# EAGLE design 1602_arduino_ble (EAGLE 8.5.1)

## Sheet 1 of 2
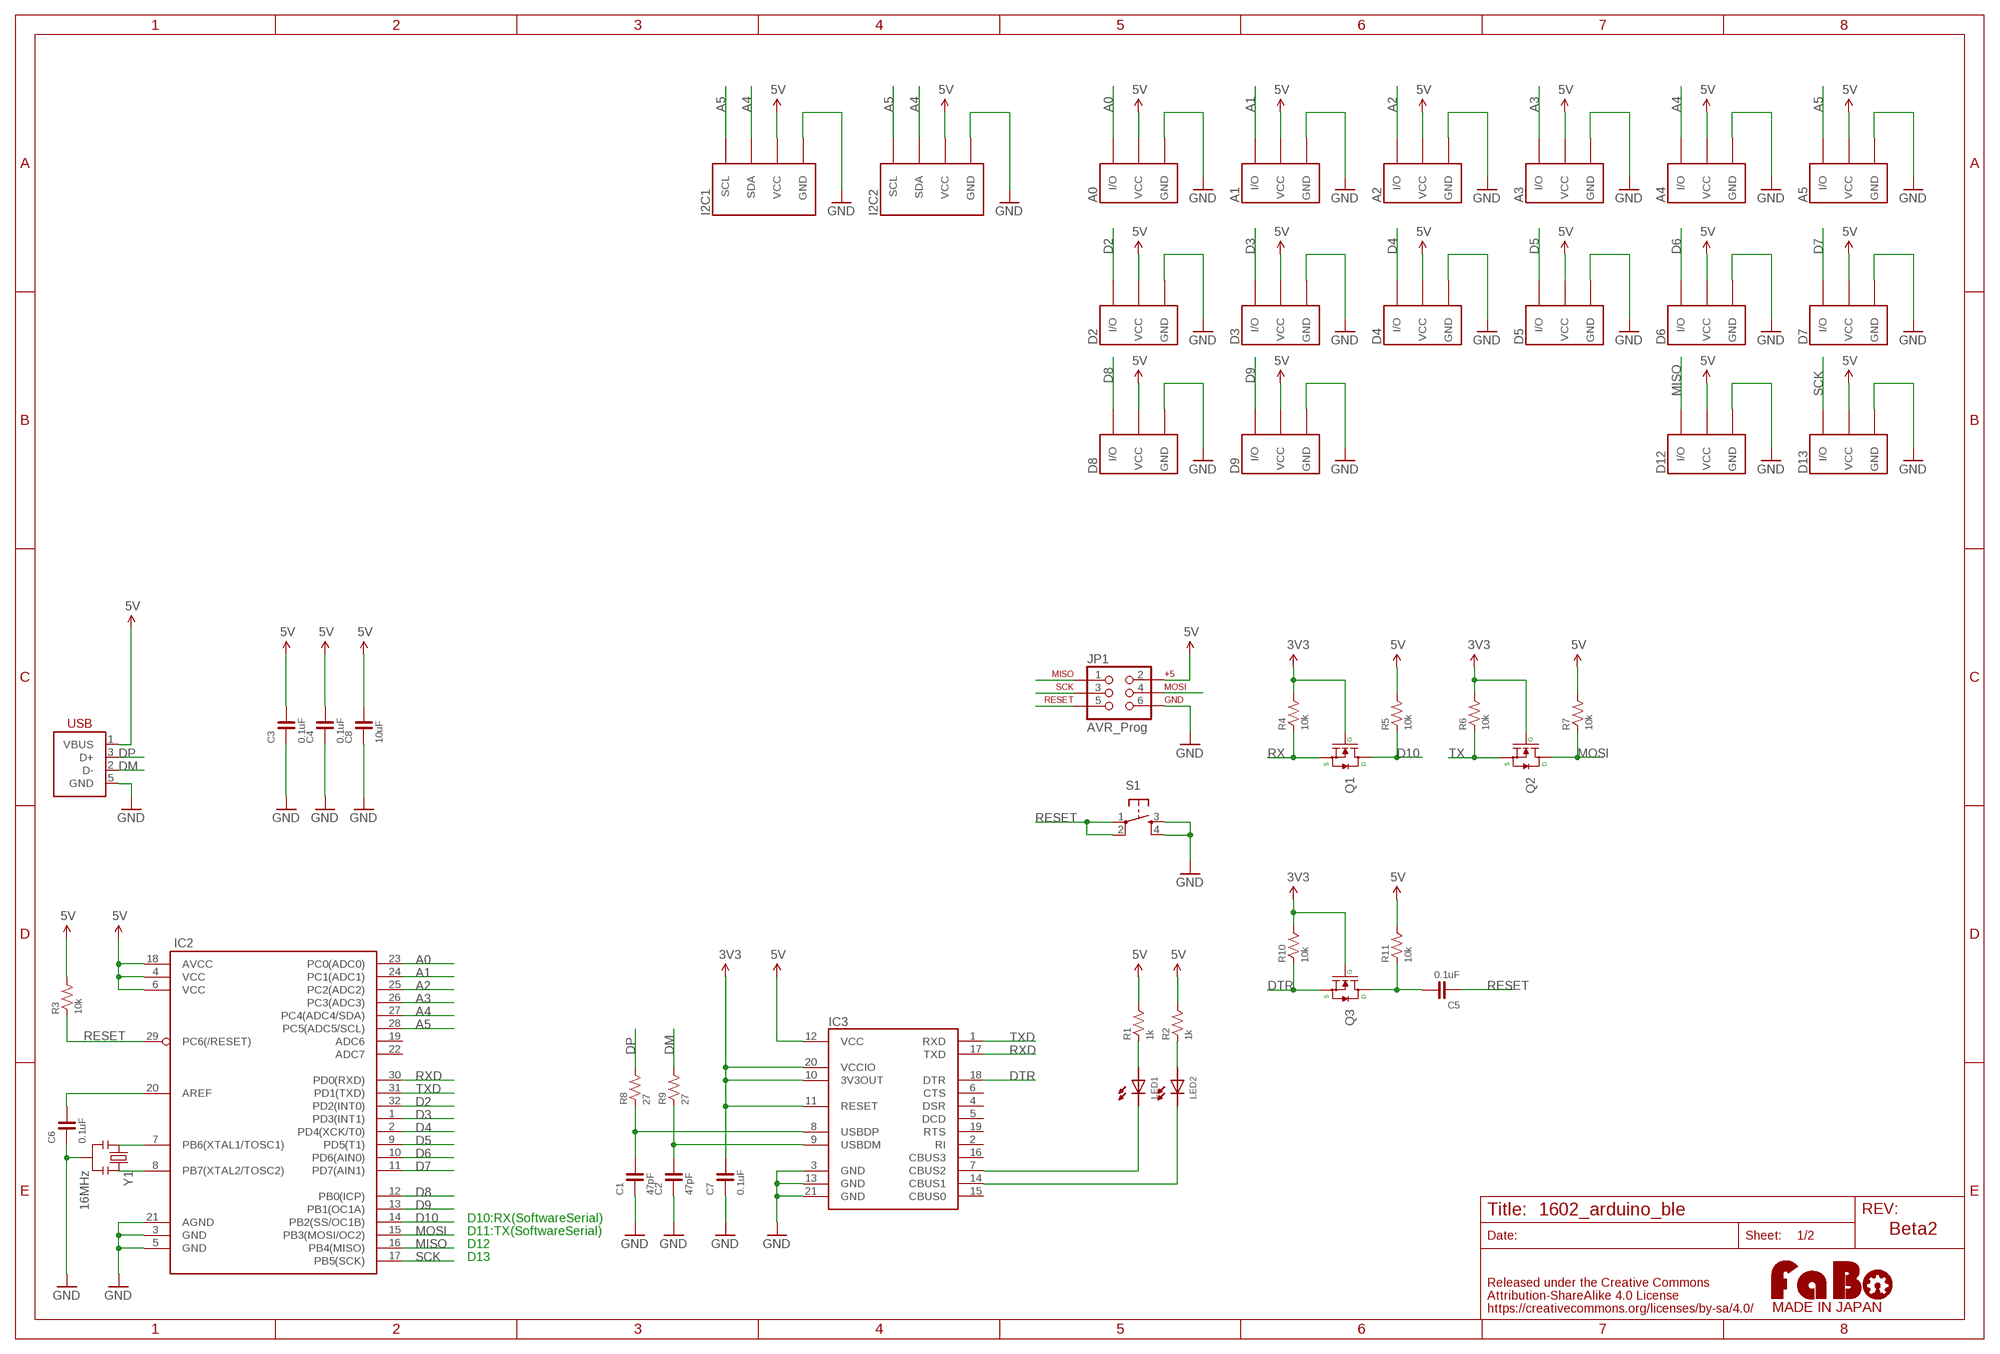
[diagram p0: schematic, sheet 1]

### Parts
A0  FABO_BRICK_3PIN-S03B-PASK-2  [FABO_BRICK_3PIN_S03B-PASK-2]
A1  FABO_BRICK_3PIN-S03B-PASK-2  [FABO_BRICK_3PIN_S03B-PASK-2]
A2  FABO_BRICK_3PIN-S03B-PASK-2  [FABO_BRICK_3PIN_S03B-PASK-2]
A3  FABO_BRICK_3PIN-S03B-PASK-2  [FABO_BRICK_3PIN_S03B-PASK-2]
A4  FABO_BRICK_3PIN-S03B-PASK-2  [FABO_BRICK_3PIN_S03B-PASK-2]
A5  FABO_BRICK_3PIN-S03B-PASK-2  [FABO_BRICK_3PIN_S03B-PASK-2]
C1  47pF  CAPACITOR-0603  [0603]
C2  47pF  CAPACITOR-0603  [0603]
C3  0.1uF  CAPACITOR-0603  [0603]
C4  0.1uF  CAPACITOR-0603  [0603]
C5  0.1uF  CAPACITOR-0603  [0603]
C6  0.1uF  CAPACITOR-0603  [0603]
C7  0.1uF  CAPACITOR-0603  [0603]
C8  10uF  CAPACITOR-0603  [0603]
D2  FABO_BRICK_3PIN-B03B-PASK-1  [FABO_BRICK_3PIN_B03B-PASK-1]
D3  FABO_BRICK_3PIN-B03B-PASK-1  [FABO_BRICK_3PIN_B03B-PASK-1]
D4  FABO_BRICK_3PIN-B03B-PASK-1  [FABO_BRICK_3PIN_B03B-PASK-1]
D5  FABO_BRICK_3PIN-B03B-PASK-1  [FABO_BRICK_3PIN_B03B-PASK-1]
D6  FABO_BRICK_3PIN-B03B-PASK-1  [FABO_BRICK_3PIN_B03B-PASK-1]
D7  FABO_BRICK_3PIN-B03B-PASK-1  [FABO_BRICK_3PIN_B03B-PASK-1]
D8  FABO_BRICK_3PIN-B03B-PASK-1  [FABO_BRICK_3PIN_B03B-PASK-1]
D9  FABO_BRICK_3PIN-B03B-PASK-1  [FABO_BRICK_3PIN_B03B-PASK-1]
D12  FABO_BRICK_3PIN-B03B-PASK-1  [FABO_BRICK_3PIN_B03B-PASK-1]
D13  FABO_BRICK_3PIN-B03B-PASK-1  [FABO_BRICK_3PIN_B03B-PASK-1]
I2C1  FABO_BRICK_I2C-S04B-PASK-2  [FABO_BRICK_I2C_S04B-PASK-2]
I2C2  FABO_BRICK_I2C-S04B-PASK-2  [FABO_BRICK_I2C_S04B-PASK-2]
IC2  ATMEGA328P-AU-TQFP32  [TQFP-32-08]
IC3  FT231XQ  [QFN-20]
JP1  AVR_Prog  AVR_ISP-TC  [TC2030-MCP]
LED1  LED-0603  [0603]
LED2  LED-0603  [0603]
Q1  MOSFET-N-BSS138  [SOT23-3]
Q2  MOSFET-N-BSS138  [SOT23-3]
Q3  MOSFET-N-BSS138  [SOT23-3]
R1  1k  RESISTOR-0603  [0603]
R2  1k  RESISTOR-0603  [0603]
R3  10k  RESISTOR-0603  [0603]
R4  10k  RESISTOR-0603  [0603]
R5  10k  RESISTOR-0603  [0603]
R6  10k  RESISTOR-0603  [0603]
R7  10k  RESISTOR-0603  [0603]
R8  27  RESISTOR-0603  [0603]
R9  27  RESISTOR-0603  [0603]
R10  10k  RESISTOR-0603  [0603]
R11  10k  RESISTOR-0603  [0603]
S1  TACT-SWITCH-SMD_KMR2  [KMR2]
U$3  LOGO_FABO-M  [LOGO_FABO_MS]
USB2  USB-MICRO_B_SMT  [DX4R005JJ2R1800]
Y1  16MHz  RESONATOR  [RESONATOR_SMD]

### Nets
3V3: C7.2 IC3.10(3V3OUT) IC3.11(RESET) IC3.20(VCCIO) Q1.1(G) Q2.1(G) Q3.1(G) R4.2 R6.2 R10.2 ; also sheet 2
5V: A0.VCC A1.VCC A2.VCC A3.VCC A4.VCC A5.VCC C3.2 C4.2 C8.2 D2.VCC D3.VCC D4.VCC D5.VCC D6.VCC D7.VCC D8.VCC D9.VCC D12.VCC D13.VCC I2C1.VCC I2C2.VCC IC2.4(VCC) IC2.6(VCC) IC2.18(AVCC) IC3.12(VCC) JP1.2 R1.2 R2.2 R3.2 R5.2 R7.2 R11.2 USB2.1(VBUS)
A0: A0.I/O IC2.23(PC0(ADC0))
A1: A1.I/O IC2.24(PC1(ADC1))
A2: A2.I/O IC2.25(PC2(ADC2))
A3: A3.I/O IC2.26(PC3(ADC3))
A4: A4.I/O I2C1.SDA I2C2.SDA IC2.27(PC4(ADC4/SDA))
A5: A5.I/O I2C1.SCL I2C2.SCL IC2.28(PC5(ADC5/SCL))
D2: D2.I/O IC2.32(PD2(INT0))
D3: D3.I/O IC2.1(PD3(INT1))
D4: D4.I/O IC2.2(PD4(XCK/T0))
D5: D5.I/O IC2.9(PD5(T1))
D6: D6.I/O IC2.10(PD6(AIN0))
D7: D7.I/O IC2.11(PD7(AIN1))
D8: D8.I/O IC2.12(PB0(ICP))
D9: D9.I/O IC2.13(PB1(OC1A))
D10: IC2.14(PB2(SS/OC1B)) Q1.3(D) R5.1 ; also sheet 2
DM: R9.2 USB2.2(D-)
DP: R8.2 USB2.3(D+)
DTR: IC3.18(DTR) Q3.2(S) R10.1
GND: A0.GND A1.GND A2.GND A3.GND A4.GND A5.GND C1.1 C2.1 C3.1 C4.1 C6.1 C7.1 C8.1 D2.GND D3.GND D4.GND D5.GND D6.GND D7.GND D8.GND D9.GND D12.GND D13.GND I2C1.GND I2C2.GND IC2.3(GND) IC2.5(GND) IC2.21(AGND) IC3.3(GND) IC3.13(GND) IC3.21(GND) JP1.6 S1.3 S1.4 USB2.5(GND) Y1.2 ; also sheet 2
MISO: D12.I/O IC2.16(PB4(MISO)) JP1.1
MOSI: IC2.15(PB3(MOSI/OC2)) JP1.4 Q2.3(D) R7.1 ; also sheet 2
N$1: LED1.ANODE R1.1
N$2: C6.2 IC2.20(AREF)
N$3: IC2.8(PB7(XTAL2/TOSC2)) Y1.3
N$4: IC2.7(PB6(XTAL1/TOSC1)) Y1.1
N$5: C1.2 IC3.8(USBDP) R8.1
N$6: C2.2 IC3.9(USBDM) R9.1
N$7: IC3.14(CBUS1) LED2.CATHODE
N$8: IC3.7(CBUS2) LED1.CATHODE
N$9: C5.2 Q3.3(D) R11.1
N$30: LED2.ANODE R2.1
RESET: C5.1 IC2.29(PC6(/RESET)) JP1.5 R3.1 S1.1 S1.2
RX: Q1.2(S) R4.1
RXD: IC2.30(PD0(RXD)) IC3.17(TXD)
SCK: D13.I/O IC2.17(PB5(SCK)) JP1.3
TX: Q2.2(S) R6.1
TXD: IC2.31(PD1(TXD)) IC3.1(RXD)
Unconnected: IC2.19(ADC6) IC2.22(ADC7) IC3.2(RI) IC3.4(DSR) IC3.5(DCD) IC3.6(CTS) IC3.15(CBUS0) IC3.16(CBUS3) IC3.19(RTS)

### Notes on the sheet
- D10:RX(SoftwareSerial)
- D11:TX(SoftwareSerial) | Beta2
- D12
- D13

## Sheet 2 of 2
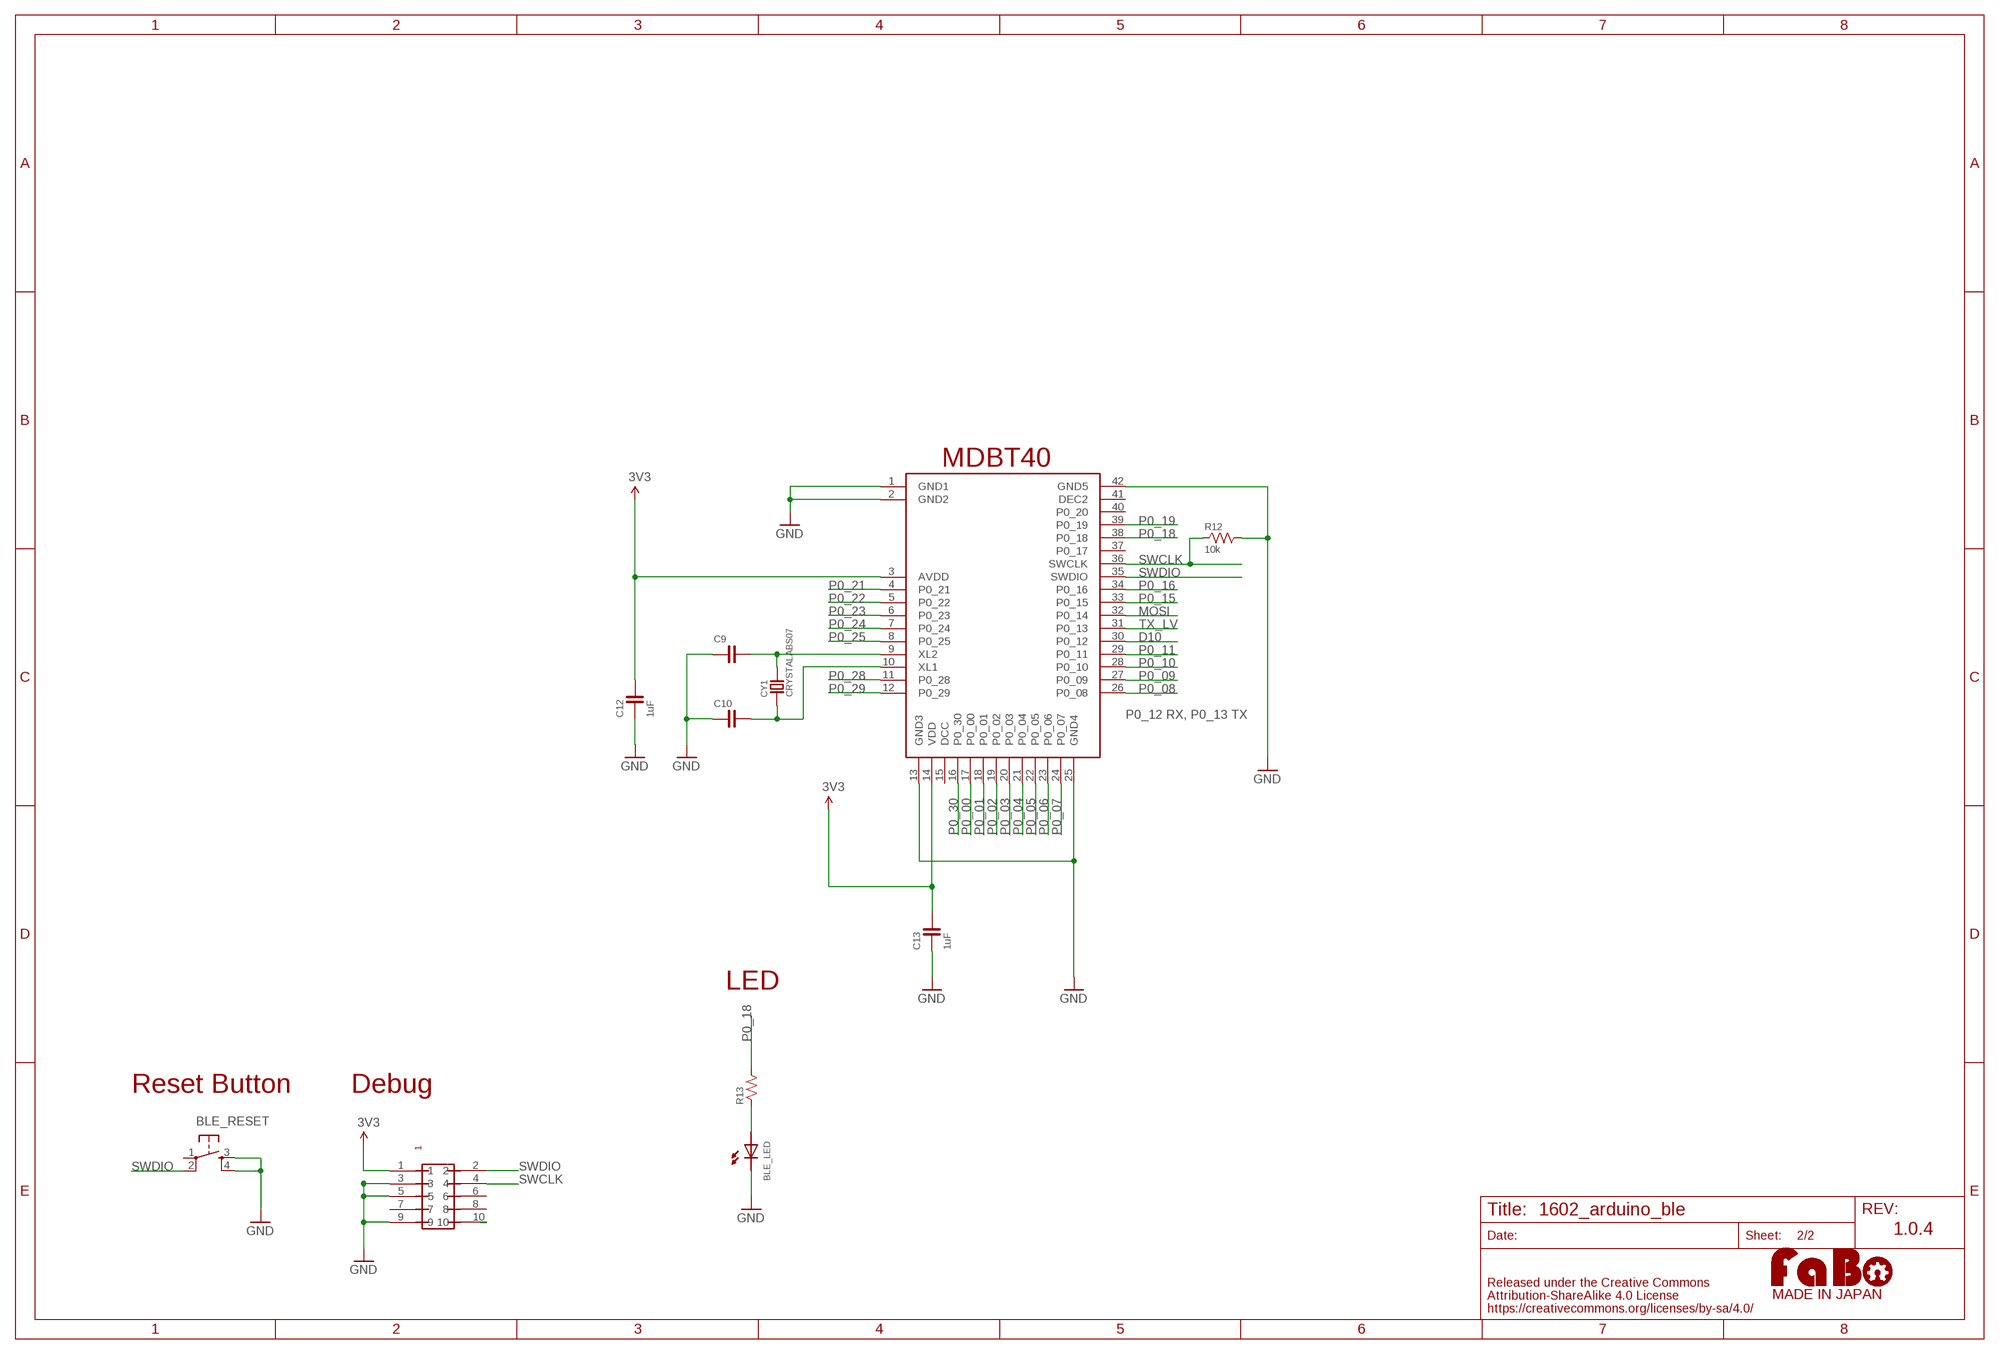
[diagram p1: schematic, sheet 2]

### Parts
BLE_LED  LED-0603  [0603]
BLE_RESET  TACT-SWITCH-SMD_KMR2  [KMR2]
C9  CAPACITOR-0603_NARROW  [0603-NARROW]
C10  CAPACITOR-0603_NARROW  [0603-NARROW]
C12  1uF  CAPACITOR-0603_NARROW  [0603-NARROW]
C13  1uF  CAPACITOR-0603_NARROW  [0603-NARROW]
CY1  CRYSTALABS07  [ABRACOM-ABS07-32.768KHZ]
R12  10k  RESISTOR-0603-NARROW  [0603-NARROW]
R13  RESISTOR-0603-NARROW  [0603-NARROW]
U$7  RAYTAC-MDBT40  [RAYTAC-MDBT40]
U$8  PIN-HEADER-SMT(1.27MM)2X5  [PIN-HEADER-SMT(1.27MM)2X5]
U$9  LOGO_FABO-M_BOTTOM  [LOGO_FABO_MS_BOTTOM]

### Nets
3V3: C12.2 C13.2 U$7.3(AVDD) U$7.14(VDD) U$8.1 ; also sheet 1
D10: U$7.30(P0_12) ; also sheet 1
GND: BLE_LED.CATHODE BLE_RESET.3 BLE_RESET.4 C9.1 C10.1 C12.1 C13.1 R12.2 U$7.1(GND1) U$7.2(GND2) U$7.13(GND3) U$7.25(GND4) U$7.42(GND5) U$8.3 U$8.5 U$8.9 ; also sheet 1
MOSI: U$7.32(P0_14) ; also sheet 1
N$10: C9.2 CY1.P$2 U$7.9(XL2)
N$11: C10.2 CY1.P$1 U$7.10(XL1)
N$12: BLE_LED.ANODE R13.1
P0_00: U$7.17(P0_00)
P0_01: U$7.18(P0_01)
P0_02: U$7.19(P0_02)
P0_03: U$7.20(P0_03)
P0_04: U$7.21(P0_04)
P0_05: U$7.22(P0_05)
P0_06: U$7.23(P0_06)
P0_07: U$7.24(P0_07)
P0_08: U$7.26(P0_08)
P0_09: U$7.27(P0_09)
P0_10: U$7.28(P0_10)
P0_11: U$7.29(P0_11)
P0_15: U$7.33(P0_15)
P0_16: U$7.34(P0_16)
P0_18: R13.2 U$7.38(P0_18)
P0_19: U$7.39(P0_19)
P0_21: U$7.4(P0_21)
P0_22: U$7.5(P0_22)
P0_23: U$7.6(P0_23)
P0_24: U$7.7(P0_24)
P0_25: U$7.8(P0_25)
P0_28: U$7.11(P0_28)
P0_29: U$7.12(P0_29)
P0_30: U$7.16(P0_30)
RESET1: U$8.10
SWCLK: R12.1 U$7.36(SWCLK) U$8.4
SWDIO: BLE_RESET.2 U$7.35(SWDIO) U$8.2
TX_LV: U$7.31(P0_13)
Unconnected: BLE_RESET.1 U$7.15(DCC) U$7.37(P0_17) U$7.40(P0_20) U$7.41(DEC2) U$8.6 U$8.7 U$8.8

### Notes on the sheet
- MDBT40
- P0_12 RX, P0_13 TX
- LED
- Reset Button | Debug
- 1.0.4

## Library data of the parts
A0 A1-A5 D2-D9 D12 D13 = FaBo-Template:FABO_BRICK_3PIN: FaBo Brick 3pin
BLE_LED LED1 LED2 = FaBo-LED:LED
BLE_RESET S1 = FaBo-Switch:TACT-SWITCH
C1-C10 C12 C13 = FaBo-Capacitor:CAPACITOR: CAPACITOR
CY1 = FaBo-Crystal:CRYSTAL
I2C1 I2C2 = FaBo-Template:FABO_BRICK_I2C: FaBo Brick I2C
IC2 = FaBo-etc:ATMEGA328P-AU: ATmega328p-AU
IC3 = FaBo-etc:FT231X
JP1 = Gclue:AVR_ISP
Q1-Q3 = FaBo-etc:MOSFET-N
R1-R13 = FaBo-Resistors:RESISTOR: RESISTOR
U$3 U$9 = FaBo-etc:LOGO_FABO
U$7 = FaBo-BT:RAYTAC-MDBT40
U$8 = Gclue:PIN-HEADER-SMT(1.27MM)2X5: PIN-HEADER-SMT (1.27MM) 2x5
USB2 = FaBo-etc:USB
Y1 = Gclue:RESONATOR: RESONATOR CSTCE16M0V53

## Board
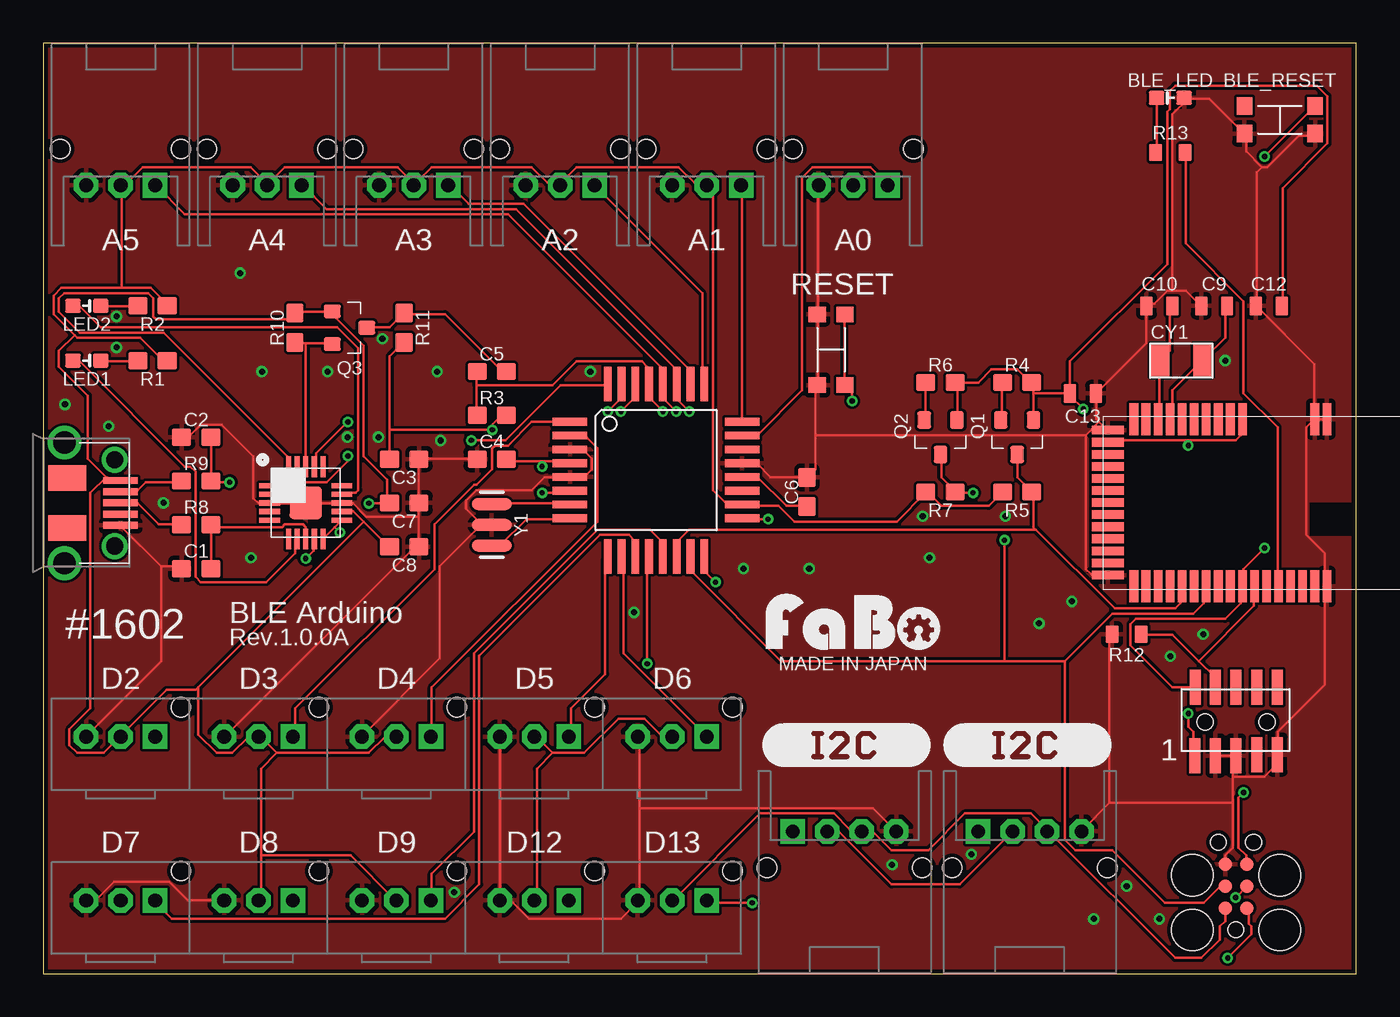
[diagram p2: board, top side]
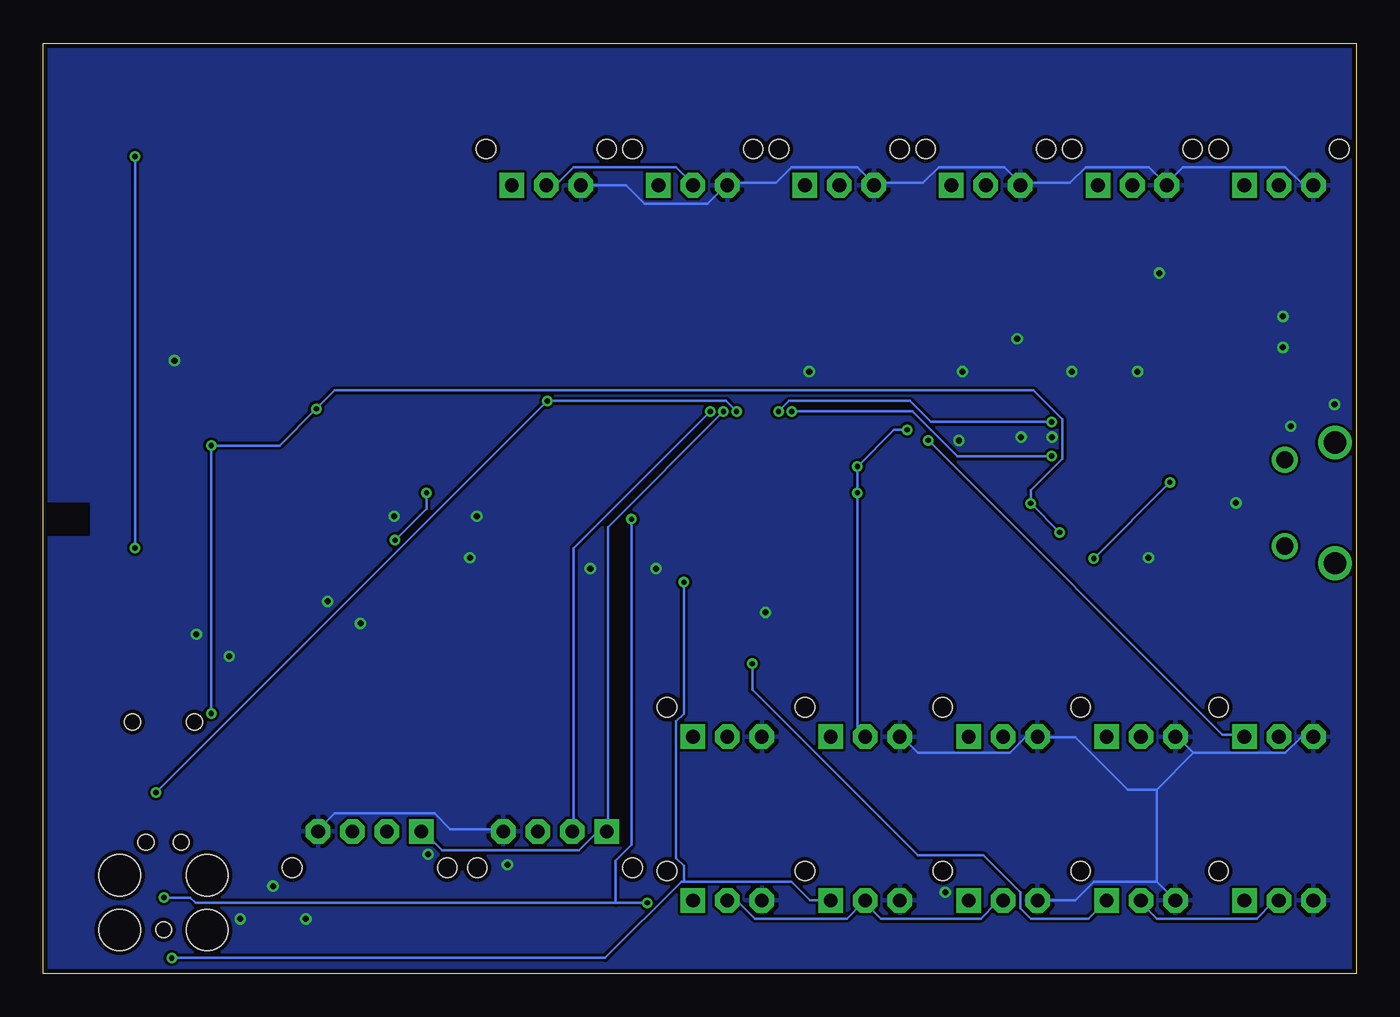
[diagram p3: board, bottom side, seen from below]

Size 76.2 x 53.98 mm. Coordinates in mm from the lower left corner, seen from the top.
Outline: 0,0 76.2,0 76.2,53.98 0,53.98 0,0
Copper layers (1*16): Top 0.035mm / dielectric 1.5mm / Bottom 0.035mm
Design rules "Elecrow_2-layer_eagle_rule": minimum track width 6mil, minimum drill 12mil, track to track 6mil, track to pad 6mil, pad to pad 6mil, via to via 6mil, smd to smd 0mil, copper to edge 10mil, drill to drill 10mil, minimum pad ring 10mil, minimum via ring 6mil, stop-mask expansion 2mil, vias tented up to drill 100mil, thermal gap 10mil

### Footprints (pad centres in the part's own frame; a part is rotated, then mirrored left to right if it is on the bottom)
FABO_BRICK_3PIN_S03B-PASK-2 = drill 0.8 pad 1.422 octagon: GND -2,0; VCC 0,0 | drill 0.8 pad 1.422 square: I/O 2,0 | hole 1.1: 3.5,2.1; -3.5,2.1
0603 = smd 0.9 x 0.8: ANODE -0.8,0; CATHODE 0.8,0
KMR2 = smd 0.9 x 1: 1 -2.05,0.8; 2 2.05,0.8; 3 2.05,-0.8; 4 -2.05,-0.8
0603' = smd 1.1 x 1: 1 -0.85,0; 2 0.85,0
0603-NARROW = smd 0.71 x 1.09: 1 -0.75,0; 2 0.75,0
ABRACOM-ABS07-32.768KHZ = smd 1.1 x 1.9: P$1 -1.25,0; P$2 1.25,0
FABO_BRICK_3PIN_B03B-PASK-1 = drill 0.8 pad 1.422 octagon: GND -2,0; VCC 0,0 | drill 0.8 pad 1.422 square: I/O 2,0 | hole 1.1: 3.5,1.7
FABO_BRICK_I2C_S04B-PASK-2 = drill 0.8 pad 1.422 octagon: GND -3,0; SDA 1,0; VCC -1,0 | drill 0.8 pad 1.422 square: SCL 3,0 | hole 1.1: 4.5,2.1; -4.5,2.1
TQFP-32-08 = smd 2 x 0.45: 1 -5,2.8; 2 -5,2; 3 -5,1.2; 4 -5,0.4; 5 -5,-0.4; 6 -5,-1.2; 7 -5,-2; 8 -5,-2.8; 17 5,-2.8; 18 5,-2; 19 5,-1.2; 20 5,-0.4; 21 5,0.4; 22 5,1.2; 23 5,2; 24 5,2.8 | smd 0.45 x 2: 9 -2.8,-5; 10 -2,-5; 11 -1.2,-5; 12 -0.4,-5; 13 0.4,-5; 14 1.2,-5; 15 2,-5; 16 2.8,-5; 25 2.8,5; 26 2,5; 27 1.2,5; 28 0.4,5; 29 -0.4,5; 30 -1.2,5; 31 -2,5; 32 -2.8,5
QFN-20 = smd 1.2 x 0.3: 1 -2.1,1; 2 -2.1,0.5; 3 -2.1,0; 4 -2.1,-0.5; 5 -2.1,-1; 11 2.1,-1; 12 2.1,-0.5; 13 2.1,0; 14 2.1,0.5; 15 2.1,1 | smd 0.3 x 1.2: 6 -1,-2.1; 7 -0.5,-2.1; 8 0,-2.1; 9 0.5,-2.1; 10 1,-2.1; 16 1,2.1; 17 0.5,2.1; 18 0,2.1; 19 -0.5,2.1; 20 -1,2.1 | smd 1.9 x 1.9: 21 0,0
TC2030-MCP = smd 0.787 x 0.787: 1 -1.27,-0.635; 2 -1.27,0.635; 3 0,-0.635; 4 0,0.635; 5 1.27,-0.635; 6 1.27,0.635 | hole 0.889: -2.54,0; 2.54,-1.016; 2.54,1.016 | hole 2.375: -2.54,2.54; -2.54,-2.54; 0.635,-2.54; 0.635,2.54
SOT23-3 = smd 0.8 x 1: 1 -0.95,-1; 2 0.95,-1; 3 0,1
0603-NARROW' = smd 0.75 x 1: 1 -0.85,0; 2 0.85,0
RAYTAC-MDBT40 = smd 1.85 x 0.5: 1 -4.86,4; 2 -4.86,3.3; 3 -4.86,-0.9; 4 -4.86,-1.6; 5 -4.86,-2.3; 6 -4.86,-3; 7 -4.86,-3.7; 8 -4.86,-4.4; 9 -4.86,-5.1; 10 -4.86,-5.8; 11 -4.86,-6.5; 12 -4.86,-7.2; 26 4.84,-7.2; 27 4.84,-6.5; 28 4.84,-5.8; 29 4.84,-5.1; 30 4.84,-4.4; 31 4.84,-3.7; 32 4.84,-3; 33 4.84,-2.3; 34 4.84,-1.6; 35 4.84,-0.9; 36 4.84,-0.2; 37 4.84,0.5; 38 4.84,1.2; 39 4.84,1.9; 40 4.84,2.6; 41 4.84,3.3; 42 4.84,4 | smd 0.5 x 1.85: 13 -4.22,-8.71; 14 -3.52,-8.71; 15 -2.82,-8.71; 16 -2.12,-8.71; 17 -1.42,-8.71; 18 -0.72,-8.71; 19 -0.02,-8.71; 20 0.68,-8.71; 21 1.38,-8.71; 22 2.08,-8.71; 23 2.78,-8.71; 24 3.48,-8.71; 25 4.18,-8.71
PIN-HEADER-SMT(1.27MM)2X5 = smd 0.635 x 2.032: 1 -2.4,-1.95; 2 -2.35,2; 3 -1.2,-1.95; 4 -1.2,2; 5 0,-1.95; 6 0,2; 7 1.2,-1.9; 8 1.2,2; 9 2.4,-1.9; 10 2.4,2 | hole 0.9: 1.8,0; -1.8,0
DX4R005JJ2R1800 = smd 0.4 x 2: 1 -1.3,4.5; 2 -0.65,4.5; 3 0,4.5; 4 0.65,4.5; 5 1.3,4.5 | smd 1.5 x 2.2: 6 -1.45,1.4; 7 1.45,1.4 | drill 1 pad 1.4: P$1 -2.5,4.15; P$2 2.5,4.15 | drill 1.3 pad 1.7: P$3 -3.5,1.25; P$4 3.5,1.25
RESONATOR_SMD = smd 0.7 x 2.3: 1 -1.2,0; 2 0,0; 3 1.2,0

### Placement (x,y rotation side)
A0  47,45.73 0 top
A1  38.5,45.73 0 top
A2  30,45.73 0 top
A3  21.5,45.73 0 top
A4  13,45.73 0 top
A5  4.5,45.73 0 top
BLE_LED  65.41,50.8 0 top
BLE_RESET  71.75,49.53 0 top
C1  47pF  [0603']  8.89,23.5 0 top
C2  47pF  [0603']  8.89,31.11 0 top
C3  0.1uF  [0603']  20.95,29.84 180 top
C4  0.1uF  [0603']  26.04,29.84 0 top
C5  0.1uF  [0603']  26.04,34.92 0 top
C6  0.1uF  [0603']  44.32,27.94 270 top
C7  0.1uF  [0603']  20.95,27.3 180 top
C8  10uF  [0603']  20.95,24.77 180 top
C9  67.94,38.73 0 top
C10  64.77,38.73 0 top
C12  71.12,38.73 0 top
C13  60.33,33.66 180 top
CY1  66.04,35.56 0 top
D2  4.5,13.75 0 top
D3  12.5,13.75 0 top
D4  20.5,13.75 0 top
D5  28.5,13.75 0 top
D6  36.5,13.75 0 top
D7  4.5,4.25 0 top
D8  12.5,4.25 0 top
D9  20.5,4.25 0 top
D12  28.5,4.25 0 top
D13  36.5,4.25 0 top
I2C1  46.5,8.25 180 top
I2C2  57.25,8.25 180 top
IC2  35.56,29.21 0 top
IC3  15.24,27.3 0 top
JP1  69.22,5.08 90 top
LED1  2.54,35.56 180 top
LED2  2.54,38.73 180 top
Q1  56.52,31.11 180 top
Q2  52.07,31.11 180 top
Q3  17.78,37.47 270 top
R1  1k  [0603']  6.35,35.56 0 top
R2  1k  [0603']  6.35,38.73 0 top
R3  10k  [0603']  26.04,32.38 0 top
R4  10k  [0603']  56.52,34.29 0 top
R5  10k  [0603']  56.52,27.94 180 top
R6  10k  [0603']  52.07,34.29 0 top
R7  10k  [0603']  52.07,27.94 180 top
R8  27  [0603']  8.89,26.04 180 top
R9  27  [0603']  8.89,28.57 180 top
R10  10k  [0603']  14.61,37.47 90 top
R11  10k  [0603']  20.95,37.47 270 top
R12  10k  [0603-NARROW']  62.87,19.68 180 top
R13  [0603-NARROW']  65.41,47.62 0 top
S1  45.72,36.2 270 top
U$3  46.99,18.41 0 top
U$4  [LOGO_SILK_I2C]  52.25,12 0 top
U$6  [LOGO_SILK_I2C]  41.75,12 0 top
U$7  70.48,27.3 270 top
U$8  69.22,14.61 0 top
U$9  -3.17,-95.89 0 top  (outside the outline)
USB2  0,27.3 270 top
Y1  26.04,26.04 270 top

### Tracks (layer width: path | path; a pad name or v marks a point on that pad's centre or on a via)
3V3  (via drill 0.3)
  Top 0.152: 16.92,25.91 17.22,26.21 IC3.11 | 16.92,25.91 16.31,25.3 IC3.10 | 16.61,38.41 14.63,38.41 R10.2 14.48,38.25 14.17,37.95 6.55,37.95 6.4,38.1 6.4,39.17 6.1,39.47 1.22,39.47 0.91,39.17 0.91,38.41 2.13,37.19 7.01,37.19 14.17,30.02 14.17,29.41 IC3.20 | 16.61,38.41 16.76,38.41 Q3.1 16.61,38.41 | 16.61,38.41 18.59,36.42 18.59,30.02 19.96,28.65 19.96,27.43 C7.2 19.96,27.28 v18.9,27.28 | v17.22,25.6 16.92,25.91 | 66.45,30.94 69.19,30.94 69.49,31.24 69.49,32.16 U$7.3 | 66.45,30.94 61.87,30.94 U$7.14 | v66.45,15.09 66.45,14.33 66.75,14.02 66.75,12.8 U$8.1 | 66.45,30.94 v66.45,30.63 | 53.03,34.29 53.03,32.16 Q2.1 | 57.45,33.68 57.45,34.29 R4.2 57.3,34.29 56.54,35.05 55.02,35.05 54.25,34.29 53.03,34.29 | 57.45,33.68 57.45,32.16 Q1.1 | 57.45,33.68 59.44,33.68 C13.2 | C12.2 71.93,38.86 71.93,45.57 74.52,48.16 74.52,50.9 73.91,51.51 65.68,51.51 65.38,51.21 65.38,50.14 65.23,49.99 65.23,41.15 59.59,35.51 59.59,33.68 C13.2 | 53.03,34.29 R6.2 | v60.35,32.77 59.59,33.53 C13.2
  Bottom 0.152: v17.22,25.6 v18.9,27.28 18.9,28.04 17.07,29.87 17.07,32.16 18.75,33.83 59.28,33.83 v60.35,32.77 62.48,30.63 v66.45,30.63 v66.45,15.09
5V  (via drill 0.3)
  Top 0.152: 1.83,37.03 0.61,38.25 0.61,39.32 1.07,39.78 4.57,39.78 | 1.83,37.03 1.98,36.88 5.64,36.88 6.86,35.66 7.16,35.66 R1.2 | 4.57,39.78 6.25,39.78 7.16,38.86 R2.2 | 3.66,28.8 2.59,29.87 2.59,33.53 0.91,35.2 0.91,36.12 1.83,37.03 | 3.66,28.8 3.81,28.65 4.42,28.65 USB2.1 3.66,28.8 | 4.57,39.78 4.57,45.72 A5.VCC 4.57,45.87 4.88,45.87 5.79,46.79 12.04,46.79 12.95,45.87 A4.VCC 13.11,45.87 14.02,46.79 20.57,46.79 21.49,45.87 A3.VCC 21.64,45.87 22.55,46.79 28.35,46.79 29.26,45.87 29.87,45.87 A2.VCC 30.02,45.87 30.94,46.79 36.88,46.79 37.8,45.87 38.41,45.87 A1.VCC 38.56,45.72 38.86,45.41 38.86,28.04 39.62,27.28 40.54,27.28 IC2.18 40.69,27.13 42.67,27.13 43.59,26.21 49.53,26.21 51.21,27.89 R7.2 51.36,27.89 52.12,27.13 54.86,27.13 55.63,27.89 R5.2 | 18.59,26.21 17.98,26.82 17.37,26.82 IC3.12 | 18.59,26.21 19.96,24.84 C8.2 | 8.99,16.61 8.84,16.46 7.16,16.46 4.57,13.87 D2.VCC 4.42,13.72 3.5,12.8 1.98,12.8 1.52,13.26 1.52,14.17 2.74,15.39 2.74,27.89 3.66,28.8 | 8.99,16.61 18.59,26.21 | 8.99,16.61 8.99,13.87 10.06,12.8 10.97,12.8 11.89,13.72 12.5,13.72 D3.VCC 12.65,13.72 13.56,12.8 | 13.56,12.8 18.9,12.8 19.81,13.72 20.42,13.72 D4.VCC | 12.65,6.86 12.65,11.89 13.56,12.8 | 12.65,6.86 12.65,4.27 D8.VCC | JP1.2 68.58,3.05 68.28,2.74 68.28,1.98 67.21,0.91 65.68,0.91 58.37,8.23 I2C2.VCC 58.22,8.38 57.3,9.3 53.49,9.3 51.36,7.16 49.23,7.16 48.16,8.23 47.55,8.23 I2C1.VCC 47.4,8.38 46.79,8.38 45.87,9.3 41.6,9.3 36.58,4.27 D13.VCC | 20.12,31.55 20.12,35.81 20.88,36.58 R11.2 | 20.12,31.55 20.12,29.87 C3.2 | 25.91,31.7 25.76,31.55 20.12,31.55 | 25.91,31.7 26.52,32.31 26.82,32.31 R3.2
  Top 0.152: 28.96,29.72 30.48,29.72 IC2.4 | 28.96,29.72 26.98,29.72 C4.2 | v28.96,27.89 30.48,27.89 IC2.6 | 29.57,12.8 31.39,12.8 33.38,14.78 34.9,14.78 35.81,13.87 36.42,13.87 D6.VCC | 29.57,12.8 28.65,13.72 D5.VCC | v28.96,29.41 28.96,29.72 | v26.06,31.55 25.91,31.7 | 29.57,12.8 28.65,11.89 28.65,4.27 D12.VCC | 12.65,6.86 17.83,6.86 20.42,4.27 D9.VCC
  Bottom 0.152: A0.VCC 46.94,45.87 46.33,45.87 45.41,46.79 39.47,46.79 38.56,45.87 A1.VCC | D7.VCC 4.57,4.12 4.88,4.12 5.79,3.2 11.58,3.2 12.5,4.12 D8.VCC | D9.VCC 20.57,4.12 20.88,4.12 21.79,3.2 27.58,3.2 28.5,4.12 D12.VCC 28.65,4.12 29.57,3.2 34.9,3.2 35.81,4.12 36.42,4.12 D13.VCC | D5.VCC 28.65,13.87 28.96,14.17 v28.96,27.89 v28.96,29.41 26.82,31.55 v26.06,31.55
A0
  Top 0.152: IC2.23 40.69,31.24 41.45,31.24 44.04,33.83 44.04,46.18 44.65,46.79 48.01,46.79 48.92,45.87 A0.I/O
A1
  Top 0.152: IC2.24 40.54,32.16 40.54,45.72 A1.I/O
A2
  Top 0.152: IC2.25 38.25,34.29 38.25,39.47 A2.I/O
A3
  Top 0.152: IC2.26 37.49,34.29 37.49,35.05 27.89,44.65 24.69,44.65 23.62,45.72 A3.I/O
A4  (via drill 0.3)
  Top 0.152: I2C1.SDA 45.57,8.23 46.18,8.23 49.23,5.18 53.19,5.18 56.24,8.23 I2C2.SDA | A4.I/O 15.09,45.72 16.46,44.35 27.43,44.35 36.73,35.05 36.73,34.29 IC2.27 36.88,34.14 36.88,33.22 v37.49,32.61
  Bottom 0.152: v37.49,32.61 45.41,24.69 45.41,8.38 I2C1.SDA
A5  (via drill 0.3)
  Top 0.152: A5.I/O 6.55,45.72 8.23,44.04 26.98,44.04 35.81,35.2 35.81,34.29 IC2.28 35.97,34.14 35.97,33.38 v36.73,32.61
  Bottom 0.152: I2C2.SCL 54.1,8.23 53.03,7.16 45.11,7.16 44.04,8.23 43.59,8.23 I2C1.SCL 43.43,8.38 43.43,25.91 v36.73,32.61
D2  (via drill 0.3)
  Top 0.152: v24.84,30.94 26.82,30.94 30.02,34.14 32.61,34.14 IC2.32
  Bottom 0.152: v24.84,30.94 7.77,13.87 6.55,13.87 D2.I/O
D3
  Top 0.152: IC2.1 30.48,32 28.35,32 26.98,30.63 26.21,30.63 26.06,30.48 26.06,29.26 25.15,28.35 24.99,28.35 22.71,26.06 22.71,23.47 14.63,15.39 14.63,13.87 D3.I/O
D4
  Top 0.152: IC2.2 30.63,31.09 31.55,31.09 32.16,30.48 32.16,26.21 22.55,16.61 22.55,13.87 D4.I/O
D5
  Top 0.152: IC2.9 32.61,24.08 32.61,17.37 30.63,15.39 30.63,13.87 D5.I/O
D6
  Top 0.152: IC2.10 33.68,24.08 33.68,18.59 38.41,13.87 D6.I/O
D7
  Top 0.152: IC2.11 34.29,24.23 34.29,25.15 33.98,25.45 32.31,25.45 25.3,18.44 25.3,5.18 23.32,3.2 7.47,3.2 6.55,4.12 D7.I/O
D8  (via drill 0.3)
  Top 0.152: v35.05,17.98 35.05,24.08 IC2.12
  Bottom 0.152: v35.05,17.98 35.05,16.46 25.45,6.86 21.64,6.86 19.51,4.72 19.51,3.81 18.9,3.2 15.54,3.2 14.63,4.12 D8.I/O
D9
  Top 0.152: IC2.13 35.81,24.23 35.81,25.15 35.2,25.76 32.16,25.76 24.99,18.59 24.99,8.23 22.55,5.79 22.55,4.27 D9.I/O
D10
  Top 0.152: Q1.3 56.54,30.02 56.54,28.8 57.3,28.04 R5.1 57.45,27.89 57.45,25.91 57.61,25.76 | 57.61,25.76 62.18,21.18 65.68,21.18 65.99,21.49 65.99,22.4 U$7.30 | 57.61,25.76 37.49,25.76 36.88,25.15 36.88,24.23 IC2.14
DM
  Top 0.152: R9.2 7.92,28.5 5.94,28.5 5.49,28.04 4.57,28.04 USB2.2
DP
  Top 0.152: R8.2 7.92,26.06 6.71,26.06 5.49,27.28 4.57,27.28 USB2.3
DTR
  Top 0.152: 15.24,36.58 14.63,36.58 R10.1 | 15.24,36.58 16.76,36.58 Q3.2 | 15.24,36.58 IC3.18
GND  (via drill 0.35)
  Top 0.152: IC2.21 40.69,29.57 41.45,29.57 42.22,28.8 44.2,28.8 C6.1 44.35,28.8 44.81,29.26 44.81,31.24 | 44.81,31.24 44.81,34.14 S1.3 44.96,34.29 44.96,38.1 S1.4 44.96,38.25 44.96,45.72 A0.GND | 34.59,9.6 34.59,4.27 D13.GND 34.44,4.12 33.53,3.2 28.19,3.2 27.28,4.12 26.52,4.12 D12.GND 26.52,4.27 26.52,13.72 D5.GND | 34.59,9.6 34.59,13.72 D6.GND | IC2.3 30.63,30.33 31.39,30.33 31.85,29.87 31.85,29.26 31.55,28.96 30.63,28.96 IC2.5 30.48,28.8 29.11,28.8 28.35,28.04 25.15,28.04 24.54,27.43 24.54,26.98 25.45,26.06 | 25.45,26.06 25.91,26.06 Y1.2 25.45,26.06 | 25.45,26.06 23.01,23.62 23.01,18.29 18.59,13.87 D4.GND | 21.79,26.52 21.79,27.28 C7.1 21.79,27.43 21.79,29.72 C3.1 21.95,29.87 25.15,29.87 C4.1 | 21.79,26.52 21.79,24.84 C8.1 21.79,24.69 21.49,24.69 10.52,13.72 D3.GND | 15.24,27.28 17.22,27.28 IC3.13 17.37,27.28 17.98,27.28 18.75,26.52 21.79,26.52 | C2.1 8.08,31.24 8.53,31.24 9.14,31.85 10.36,31.85 12.19,30.02 12.19,27.58 12.5,27.28 13.11,27.28 IC3.3 13.26,27.28 15.24,27.28 | 15.24,27.28 IC3.21 | D7.GND 2.59,4.27 3.05,4.27 4.12,5.33 7.32,5.33 8.38,4.27 10.36,4.27 D8.GND | 6.86,23.62 7.92,23.62 C1.1 | 6.86,23.62 4.57,25.91 USB2.5 | 6.86,23.62 6.86,18.14 2.59,13.87 D2.GND | JP1.6 68.58,6.86 69.04,7.32 69.04,9.91 | 69.04,11.43 69.04,12.5 69.19,12.65 | 69.04,11.43 69.04,9.91 | 69.19,12.65 68.12,12.65 U$8.3 | 69.19,12.65 U$8.5 | 69.04,11.43 70.87,11.43 71.48,12.04 71.48,12.65 U$8.9 71.63,12.8 71.63,14.02 74.37,16.76 74.37,22.4 U$7.42 74.37,22.55 74.37,24.38 73.3,25.45 73.3,31.7 73.76,32.16 U$7.2 | 61.87,9.91 61.87,19.66 R12.2 | 61.87,9.91 60.35,8.38 I2C2.GND | 61.87,9.91 69.04,9.91
  Top 0.152: 65.53,39.62 66.29,39.62 67.06,38.86 C9.1 | 65.53,39.62 65.23,39.62 64.47,38.86 64.16,38.86 C10.1 64.01,38.71 64.01,36.58 61.11,33.68 C13.1 61.11,33.53 61.11,32.16 61.27,32 | 61.27,32 61.72,31.55 U$7.13 | 60.5,31.24 60.5,23.47 60.81,23.16 61.72,23.16 U$7.25 | 61.27,32 60.5,31.24 | U$7.2 73.91,32.16 74.37,32.16 U$7.1 | 66.45,50.75 67.67,50.75 69.65,48.77 BLE_RESET.4 69.8,48.62 69.8,47.7 70.71,46.79 | 66.45,50.75 66.29,50.75 BLE_LED.CATHODE 66.45,50.75 | 70.71,46.79 71.02,46.79 72.85,48.62 73.76,48.62 BLE_RESET.3 | 70.71,46.79 70.41,46.48 70.41,38.86 C12.1 70.41,38.71 73.76,35.36 73.76,32.31 U$7.2 | 65.53,39.62 65.53,49.84 66.45,50.75 | 34.59,9.6 48.16,9.6 49.38,8.38 I2C1.GND | 60.5,31.24 44.81,31.24
  Bottom 0.152: A5.GND 2.59,45.87 3.2,45.87 4.12,46.79 10.06,46.79 10.97,45.87 A4.GND 11.12,45.87 12.04,46.79 15.7,46.79 16.61,45.87 19.36,45.87 A3.GND 19.51,45.87 20.42,46.79 24.23,46.79 25.15,45.87 27.89,45.87 A2.GND 28.04,45.87 28.96,46.79 32.77,46.79 33.68,45.87 36.42,45.87 A1.GND 36.58,45.72 37.64,44.65 41.3,44.65 42.37,45.72 44.96,45.72 A0.GND | D5.GND 26.36,13.72 25.45,12.8 20.12,12.8 19.2,13.72 18.59,13.72 D4.GND 18.44,13.72 16.31,13.72 13.26,10.67 11.58,10.67 | 11.58,5.33 15.24,5.33 16.31,4.27 18.44,4.27 D9.GND | 11.58,5.33 10.52,4.27 D8.GND | 9.45,12.8 4.12,12.8 3.2,13.72 2.59,13.72 D2.GND | 9.45,12.8 10.36,13.72 D3.GND | 11.58,10.67 11.58,5.33 | 9.45,12.8 11.58,10.67 | I2C1.GND 49.53,8.38 52.58,8.38 53.49,9.3 59.28,9.3 60.2,8.38 I2C2.GND
  other vias: 11.43,40.64 12.7,34.92 51.44,24.13 44.45,23.5 40.64,23.5 34.29,20.95 68.58,35.56 67.31,19.68 65.41,18.41 59.69,21.59 57.78,20.32 22.86,34.92 19.68,36.83 3.81,31.75 1.27,33.02 12.06,24.13 6.99,27.3 16.51,34.92 62.87,5.08 64.77,3.17 60.96,3.17 31.75,34.92 23.06,30.93 19.46,31.12 17.66,31.12 23.86,4.72 49.26,6.33 53.86,6.92 4.26,36.33 4.26,38.12 51.03,26.53 55.84,26.53
  pour Top: 0,0 0,53.98 76.2,53.98 76.2,0
  pour Bottom: 0,0 0,53.98 76.2,53.98 76.2,0
MISO  (via drill 0.3)
  Top 0.152: v68.73,0.91 70.1,2.29 70.1,2.74 69.95,2.9 69.95,3.81 JP1.1 | v39.01,22.71 38.41,23.32 38.41,24.08 IC2.16
  Bottom 0.152: v68.73,0.91 43.59,0.91 39.17,5.33 39.01,5.33 | 39.01,5.33 32.77,5.33 31.7,4.27 30.63,4.27 D12.I/O | v39.01,22.71 39.01,15.09 39.47,14.63 39.47,6.71 39.01,6.25 39.01,5.33
MOSI  (via drill 0.3)
  Top 0.152: Q2.3 52.12,30.02 52.12,28.8 52.88,28.04 R7.1 53.03,27.89 v53.95,27.89 | 59.28,18.14 59.28,7.77 59.89,7.16 62.03,7.16 65.08,4.12 67.36,4.12 68.28,5.03 68.58,5.03 JP1.4 | 59.28,18.14 62.03,20.88 66.75,20.88 67.36,21.49 67.36,22.4 U$7.32 | 59.28,18.14 55.78,18.14 | 55.78,18.14 42.82,18.14 37.64,23.32 37.64,24.08 IC2.15 | 55.78,18.14 v55.78,25.15
  Bottom 0.152: v53.95,27.89 53.95,26.98 v55.78,25.15
N$1
  Top 0.152: LED1.ANODE 3.35,35.51 5.49,35.51 R1.1
N$2
  Top 0.152: C6.2 44.2,27.13 43.13,27.13 41.45,28.8 40.69,28.8 IC2.20
N$3
  Top 0.152: IC2.8 30.48,26.36 28.04,26.36 26.52,24.84 26.06,24.84 Y1.3
N$4
  Top 0.152: IC2.7 30.48,27.28 26.06,27.28 Y1.1
N$5
  Top 0.152: 9.75,25.91 9.75,23.62 C1.2 | IC3.8 15.24,25.91 15.09,26.06 14.02,26.06 13.87,25.91 9.75,25.91 | 9.75,25.91 R8.1
N$6  (via drill 0.3)
  Top 0.152: C2.2 9.75,31.09 9.75,28.65 R9.1 9.75,28.5 v10.82,28.5 | v15.24,24.08 15.7,24.54 15.7,25.15 IC3.9
  Bottom 0.152: v10.82,28.5 v15.24,24.08
N$7
  Top 0.152: LED2.CATHODE 1.83,38.71 2.13,38.71 3.35,37.49 17.07,37.49 18.29,36.27 18.29,28.04 18.14,27.89 17.37,27.89 IC3.14
N$8
  Top 0.152: LED1.CATHODE 1.83,35.51 2.13,35.51 8.23,29.41 8.53,29.41 8.84,29.11 8.84,23.01 9.14,22.71 12.95,22.71 14.63,24.38 14.63,25.15 IC3.7
N$9
  Top 0.152: Q3.3 18.9,37.49 20.12,37.49 20.88,38.25 R11.1 21.03,38.25 23.32,38.25 26.52,35.05 26.82,35.05 C5.2
N$10
  Top 0.152: C9.2 68.58,38.71 68.58,36.88 67.36,35.66 CY1.P$2 67.21,35.51 65.53,33.83 65.53,32.31 U$7.9
N$11
  Top 0.152: C10.2 65.38,38.71 65.38,36.12 64.92,35.66 CY1.P$1 64.77,35.51 64.77,32.31 U$7.10
N$12
  Top 0.152: BLE_LED.ANODE 64.62,50.75 64.62,47.7 R13.1
N$30
  Top 0.152: LED2.ANODE 3.35,38.71 5.49,38.71 R2.1
P0_18
  Top 0.152: R13.2 66.29,47.55 66.29,42.37 69.65,39.01 69.65,33.68 71.63,31.7 71.63,22.55 U$7.38
RESET  (via drill 0.3)
  Top 0.152: 25.15,34.14 25.15,34.9 C5.1 | 25.15,34.14 25.15,32.46 R3.1 | 25.15,34.14 29.57,34.14 30.94,35.51 34.75,35.51 35.05,35.2 35.05,34.29 IC2.29 35.2,34.14 35.2,33.38 v35.97,32.61 | v69.65,10.52 69.34,10.21 69.34,7.32 69.8,6.86 69.8,6.4 JP1.5 | v46.94,33.22 46.94,33.83 46.63,34.14 S1.2 46.48,34.29 46.48,38.1 S1.1
  Bottom 0.152: v69.65,10.52 v46.94,33.22 36.58,33.22 v35.97,32.61
RX
  Top 0.152: Q1.2 55.63,32.16 55.63,34.29 R4.1
RXD  (via drill 0.3)
  Top 0.152: v17.68,32 15.85,30.18 15.85,29.41 IC3.17 | v33.53,32.61 34.29,33.38 34.29,34.14 IC2.30
  Bottom 0.152: v17.68,32 24.69,32 25.91,33.22 32.92,33.22 v33.53,32.61
SCK  (via drill 0.3)
  Top 0.152: v69.19,4.42 JP1.3 | v41.15,4.12 38.56,4.12 D13.I/O | v42.06,26.36 40.69,26.36 IC2.17
  Bottom 0.152: v69.19,4.42 67.67,4.42 67.36,4.12 42.98,4.12 | v41.15,4.12 42.98,4.12 | v42.06,26.36 42.06,7.47 42.98,6.55 42.98,4.12
SWCLK
  Top 0.152: 67.06,18.14 67.97,17.22 67.97,16.61 U$8.4 | 67.06,18.14 65.53,19.66 63.86,19.66 R12.1 | 67.06,18.14 70.26,21.34 70.26,22.4 U$7.36
SWDIO  (via drill 0.3)
  Top 0.152: v70.87,47.4 73.76,50.29 BLE_RESET.2 | v70.87,24.69 69.65,23.47 69.65,22.55 U$7.35 69.49,22.4 69.49,21.49 68.58,20.57 63.4,20.57 63.09,20.27 63.09,19.05 65.53,16.61 66.75,16.61 U$8.2
  Bottom 0.152: v70.87,24.69 v70.87,47.4
TX
  Top 0.152: Q2.2 51.21,32.16 51.21,34.29 R6.1
TXD  (via drill 0.3)
  Top 0.152: v17.68,30.02 17.68,29.72 16.46,28.5 14.33,28.5 14.17,28.35 13.26,28.35 IC3.1 | v32.77,32.61 33.53,33.38 33.53,34.14 IC2.31
  Bottom 0.152: v17.68,30.02 23.16,30.02 25.76,32.61 v32.77,32.61

### Text on the board
tPlace: RESET | #1602 | BLE Arduino | Rev.1.0.0A | MADE IN JAPAN